# Altium schematic sheet sbcs.SchDoc
size A3; DocumentNumber: 43; SheetNumber: 43; SheetTotal: 45; SheetDescription: System basic chips for MCU and peripherals
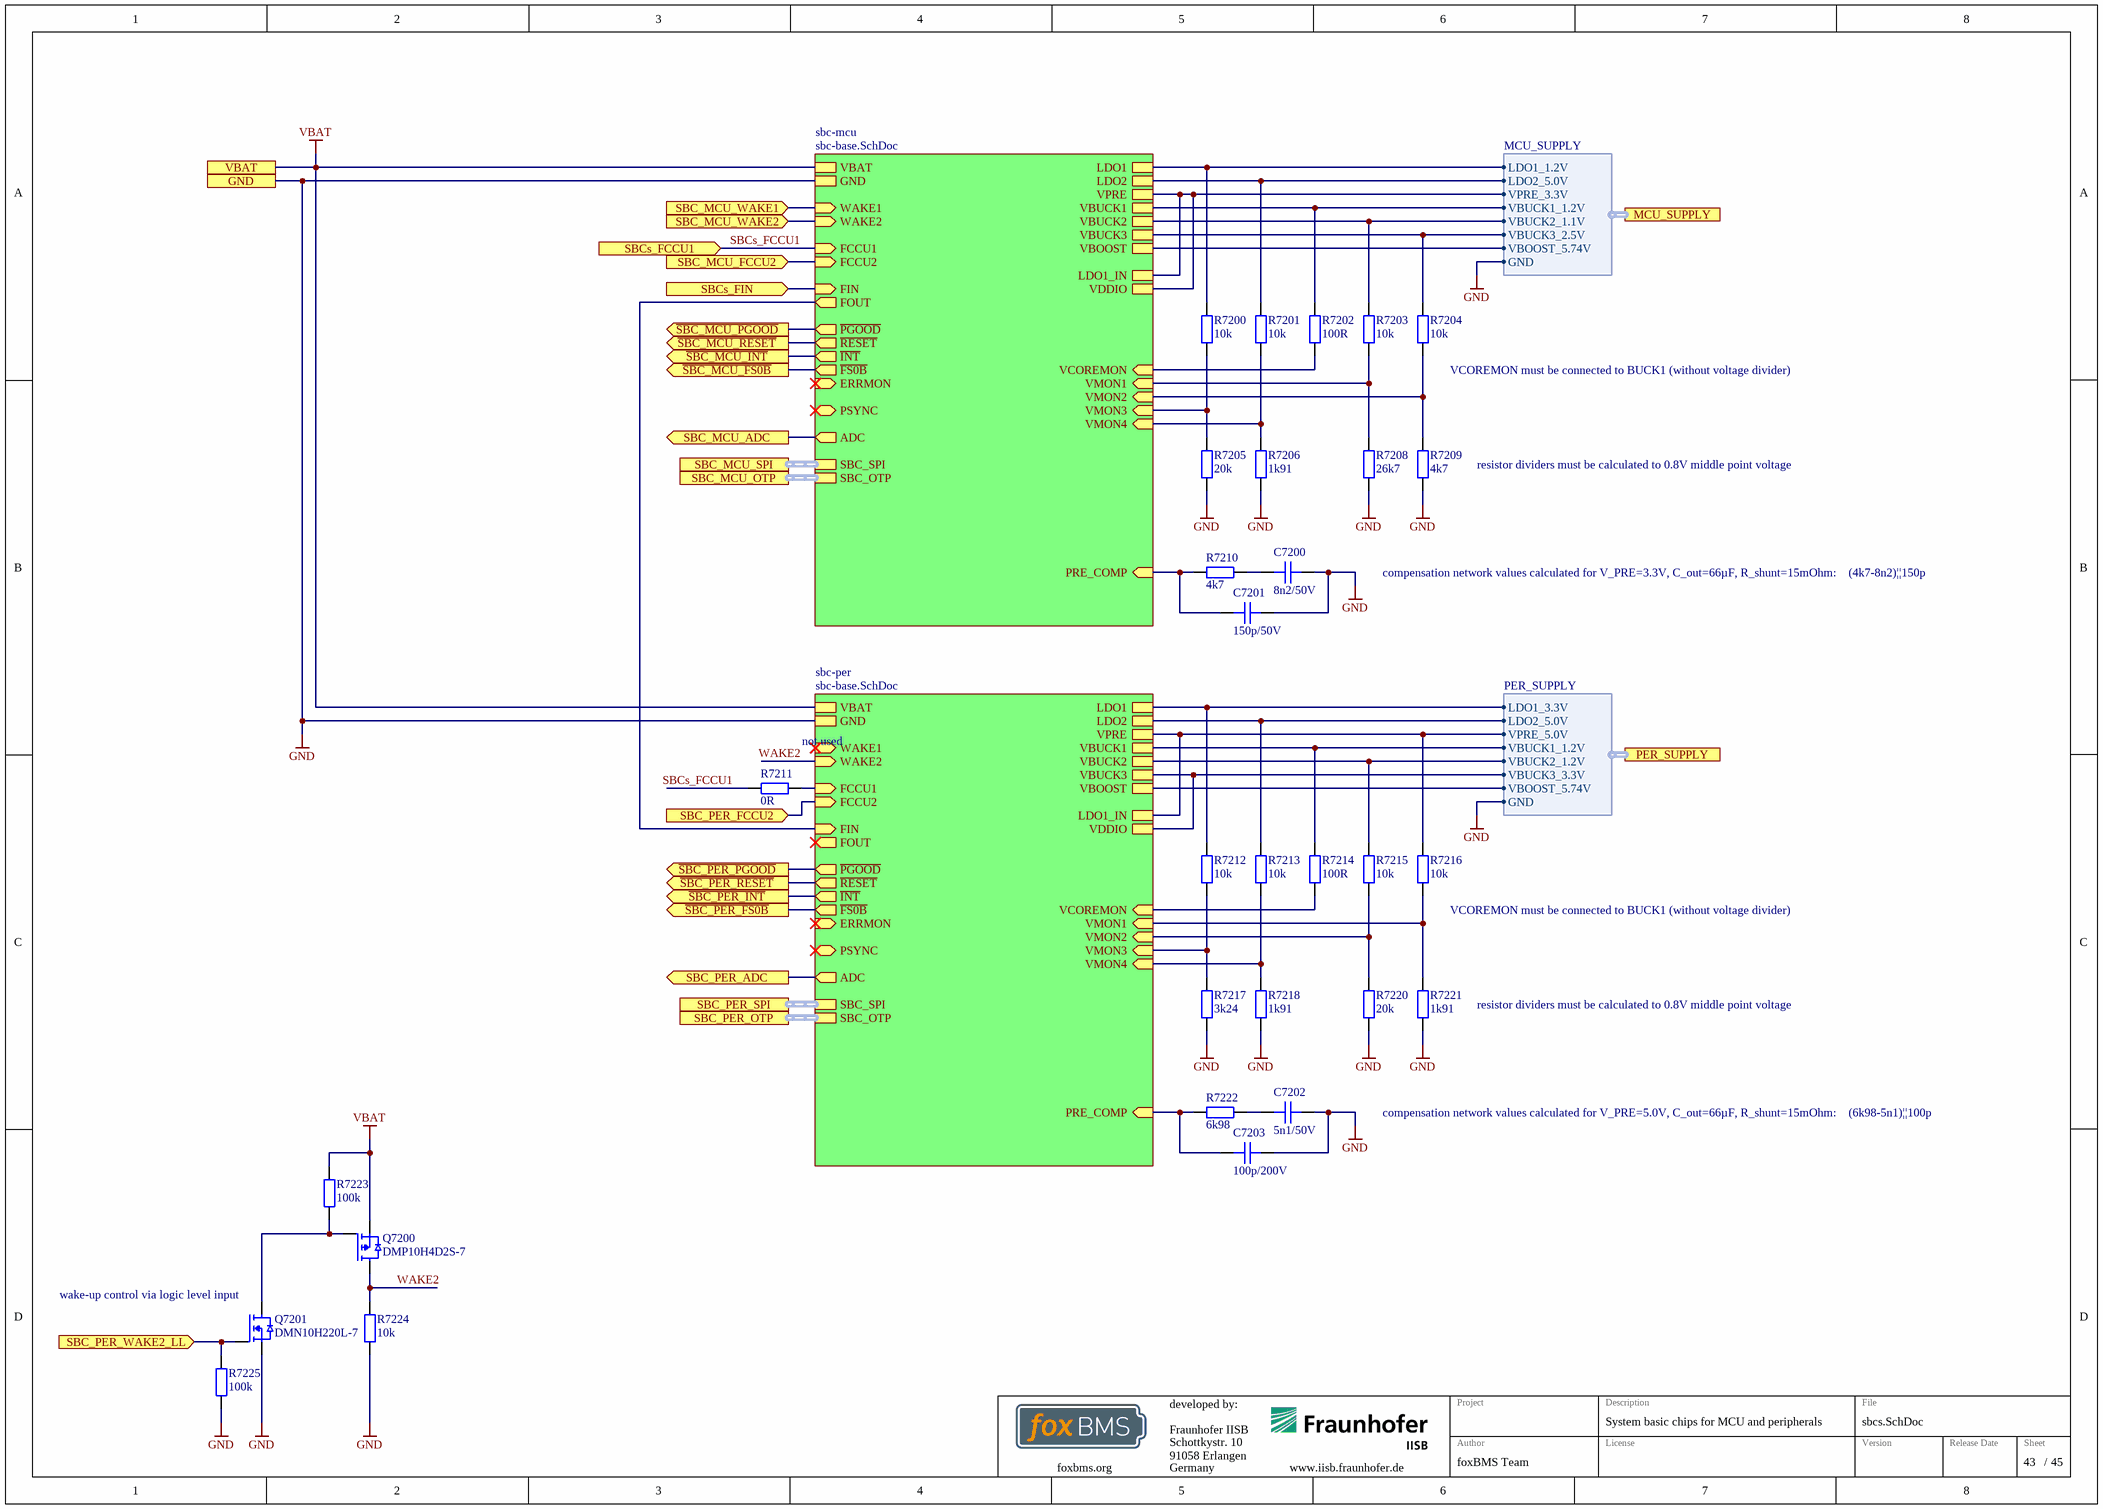
[diagram p0: sbcs.SchDoc]

## Parts
C7200  8n2/50V  [CAPC1608X08N]
C7201  150p/50V  [CAPC1005X06N]
C7202  5n1/50V  [CAPC1608X08N]
C7203  100p/200V  [CAPC1005X06N]
Q7200  DMP10H4D2S-7  [SOT95P237X110-3N]
Q7201  DMN10H220L-7  [SOT95P237X110-3N]
R7200  10k  [RESC1005X04N]
R7201  10k  [RESC1005X04N]
R7202  100R  [RESC1005X04N]
R7203  10k  [RESC1005X04N]
R7204  10k  [RESC1005X04N]
R7205  20k  [RESC1005X04N]
R7206  1k91  [RESC1005X04N]
R7208  26k7  [RESC1005X04N]
R7209  4k7  [RESC1005X04N]
R7210  4k7  [RESC1005X04N]
R7211  0R  [RESC1005X04N]
R7212  10k  [RESC1005X04N]
R7213  10k  [RESC1005X04N]
R7214  100R  [RESC1005X04N]
R7215  10k  [RESC1005X04N]
R7216  10k  [RESC1005X04N]
R7217  3k24  [RESC1005X04N]
R7218  1k91  [RESC1005X04N]
R7220  20k  [RESC1005X04N]
R7221  1k91  [RESC1005X04N]
R7222  6k98  [RESC1005X04N]
R7223  100k  [RESC1005X04N]
R7224  10k  [RESC1005X04N]
R7225  100k  [RESC1005X04N]

## Sub-sheets
sbc-mcu = sbc-base.SchDoc: ERRMON (in), FCCU1 (in), ~{FS0B} (out), ~{INT} (out), WAKE2 (in), VBAT, GND, ~{PGOOD} (out), ~{RESET} (out), FOUT (out), ADC (out), FCCU2 (in), PSYNC (bidir), SBC_OTP (harness SBC_OTP), VBUCK3, FIN (in), LDO2, VPRE, VBUCK1, VBUCK2, VCOREMON (in), VMON1 (in), VMON2 (in), VDDIO, LDO1_IN, PRE_COMP (in), VMON3 (in), VBOOST, SBC_SPI (harness SPI), LDO1, VMON4 (in), WAKE1 (in)
sbc-per = sbc-base.SchDoc: ERRMON (in), FCCU1 (in), ~{FS0B} (out), ~{INT} (out), WAKE2 (in), VBAT, GND, ~{PGOOD} (out), ~{RESET} (out), FOUT (out), ADC (out), FCCU2 (in), PSYNC (bidir), SBC_OTP (harness SBC_OTP), VBUCK3, FIN (in), LDO2, VPRE, VBUCK1, VBUCK2, VCOREMON (in), VMON1 (in), VMON2 (in), VDDIO, LDO1_IN, PRE_COMP (in), VMON3 (in), VBOOST, SBC_SPI (harness SPI), LDO1, VMON4 (in), WAKE1 (in)

## Ports
GND, MCU_SUPPLY (harness MCU_SUPPLY), PER_SUPPLY (harness PER_SUPPLY), SBC_MCU_ADC (out), SBC_MCU_FCCU2 (in), SBC_MCU_OTP (harness SBC_OTP), SBC_MCU_SPI (harness SPI), SBC_MCU_WAKE1 (in), SBC_MCU_WAKE2 (in), SBC_PER_ADC (out), SBC_PER_FCCU2 (in), SBC_PER_OTP (harness SBC_OTP), SBC_PER_SPI (harness SPI), SBC_PER_WAKE2_LL (in), SBCs_FCCU1 (in), SBCs_FIN (in), VBAT, ~{SBC_MCU_FS0B} (out), ~{SBC_MCU_INT} (out), ~{SBC_MCU_PGOOD} (out), ~{SBC_MCU_RESET} (out), ~{SBC_PER_FS0B} (out), ~{SBC_PER_INT} (out), ~{SBC_PER_PGOOD} (out), ~{SBC_PER_RESET} (out)

## Harnesses
MCU_SUPPLY: VBUCK1_1.2V, VBUCK2_1.1V, VBUCK3_2.5V, LDO1_1.2V, LDO2_5.0V, GND, VPRE_3.3V, VBOOST_5.74V
PER_SUPPLY: GND, VBOOST_5.74V, LDO1_3.3V, LDO2_5.0V, VPRE_5.0V, VBUCK1_1.2V, VBUCK2_1.2V, VBUCK3_3.3V

## Nets
GND: C7200.2 C7201.2 C7202.2 C7203.2 Q7201.S R7205.1 R7206.1 R7208.1 R7209.1 R7217.1 R7218.1 R7220.1 R7221.1 R7224.1 R7225.2 ; port GND, sheet sbc-mcu/GND, sheet sbc-per/GND, port MCU_SUPPLY.GND, port PER_SUPPLY.GND
VBAT: Q7200.S R7223.1 ; port VBAT, sheet sbc-mcu/VBAT, sheet sbc-per/VBAT
~{SBC_MCU_FS0B}: port ~{SBC_MCU_FS0B}, sheet sbc-mcu/~{FS0B}
~{SBC_MCU_INT}: port ~{SBC_MCU_INT}, sheet sbc-mcu/~{INT}
~{SBC_MCU_PGOOD}: port ~{SBC_MCU_PGOOD}, sheet sbc-mcu/~{PGOOD}
~{SBC_MCU_RESET}: port ~{SBC_MCU_RESET}, sheet sbc-mcu/~{RESET}
~{SBC_PER_FS0B}: port ~{SBC_PER_FS0B}, sheet sbc-per/~{FS0B}
~{SBC_PER_INT}: port ~{SBC_PER_INT}, sheet sbc-per/~{INT}
~{SBC_PER_PGOOD}: port ~{SBC_PER_PGOOD}, sheet sbc-per/~{PGOOD}
~{SBC_PER_RESET}: port ~{SBC_PER_RESET}, sheet sbc-per/~{RESET}
SBC_MCU_ADC: port SBC_MCU_ADC, sheet sbc-mcu/ADC
SBC_MCU_FCCU2: port SBC_MCU_FCCU2, sheet sbc-mcu/FCCU2
SBC_MCU_WAKE1: port SBC_MCU_WAKE1, sheet sbc-mcu/WAKE1
SBC_MCU_WAKE2: port SBC_MCU_WAKE2, sheet sbc-mcu/WAKE2
SBC_PER_ADC: port SBC_PER_ADC, sheet sbc-per/ADC
SBC_PER_FCCU2: port SBC_PER_FCCU2, sheet sbc-per/FCCU2
SBC_PER_WAKE2_LL: Q7201.G R7225.1 ; port SBC_PER_WAKE2_LL
SBCs_FCCU1: R7211.1 ; port SBCs_FCCU1, sheet sbc-mcu/FCCU1
SBCs_FIN: port SBCs_FIN, sheet sbc-mcu/FIN
WAKE2: Q7200.D R7224.2 ; sheet sbc-per/WAKE2
NetC7200_1: C7200.1 R7210.1
NetC7201_1: C7201.1 R7210.2 ; sheet sbc-mcu/PRE_COMP
NetC7202_1: C7202.1 R7222.1
NetC7203_1: C7203.1 R7222.2 ; sheet sbc-per/PRE_COMP
NetQ7200_G: Q7200.G Q7201.D R7223.2
NetR7200_1: R7200.1 R7205.2 ; sheet sbc-mcu/VMON3
NetR7200_2: R7200.2 ; sheet sbc-mcu/LDO1, port MCU_SUPPLY.LDO1_1.2V
NetR7201_1: R7201.1 R7206.2 ; sheet sbc-mcu/VMON4
NetR7201_2: R7201.2 ; sheet sbc-mcu/LDO2, port MCU_SUPPLY.LDO2_5.0V
NetR7202_1: R7202.1 ; sheet sbc-mcu/VCOREMON
NetR7202_2: R7202.2 ; sheet sbc-mcu/VBUCK1, port MCU_SUPPLY.VBUCK1_1.2V
NetR7203_1: R7203.1 R7208.2 ; sheet sbc-mcu/VMON1
NetR7203_2: R7203.2 ; sheet sbc-mcu/VBUCK2, port MCU_SUPPLY.VBUCK2_1.1V
NetR7204_1: R7204.1 R7209.2 ; sheet sbc-mcu/VMON2
NetR7204_2: R7204.2 ; sheet sbc-mcu/VBUCK3, port MCU_SUPPLY.VBUCK3_2.5V
NetR7211_2: R7211.2 ; sheet sbc-per/FCCU1
NetR7212_1: R7212.1 R7217.2 ; sheet sbc-per/VMON3
NetR7212_2: R7212.2 ; sheet sbc-per/LDO1, port PER_SUPPLY.LDO1_3.3V
NetR7213_1: R7213.1 R7218.2 ; sheet sbc-per/VMON4
NetR7213_2: R7213.2 ; sheet sbc-per/LDO2, port PER_SUPPLY.LDO2_5.0V
NetR7214_1: R7214.1 ; sheet sbc-per/VCOREMON
NetR7214_2: R7214.2 ; sheet sbc-per/VBUCK1, port PER_SUPPLY.VBUCK1_1.2V
NetR7215_1: R7215.1 R7220.2 ; sheet sbc-per/VMON2
NetR7215_2: R7215.2 ; sheet sbc-per/VBUCK2, port PER_SUPPLY.VBUCK2_1.2V
NetR7216_1: R7216.1 R7221.2 ; sheet sbc-per/VMON1
NetR7216_2: R7216.2 ; sheet sbc-per/VPRE, sheet sbc-per/LDO1_IN, port PER_SUPPLY.VPRE_5.0V
(unnamed): sheet sbc-mcu/FOUT, sheet sbc-per/FIN
(unnamed): sheet sbc-mcu/VPRE, sheet sbc-mcu/VDDIO, sheet sbc-mcu/LDO1_IN, port MCU_SUPPLY.VPRE_3.3V
(unnamed): sheet sbc-mcu/VBOOST, port MCU_SUPPLY.VBOOST_5.74V
(unnamed): sheet sbc-per/VBUCK3, sheet sbc-per/VDDIO, port PER_SUPPLY.VBUCK3_3.3V
(unnamed): sheet sbc-per/VBOOST, port PER_SUPPLY.VBOOST_5.74V

## Buses and harness runs
harness port SBC_MCU_OTP = sheet sbc-mcu/SBC_OTP
harness port SBC_MCU_SPI = sheet sbc-mcu/SBC_SPI
harness port SBC_PER_OTP = sheet sbc-per/SBC_OTP
harness port SBC_PER_SPI = sheet sbc-per/SBC_SPI

## Notes on the sheet
- (near R7204) VCOREMON must be connected to BUCK1 (without voltage divider)
- resistor dividers must be calculated to 0.8V middle point voltage
- compensation network values calculated for V_PRE=3.3V, C_out=66µF, R_shunt=15mOhm:
- (4k7-8n2)||150p
- (near R7211) not used
- (near R7216) VCOREMON must be connected to BUCK1 (without voltage divider)
- compensation network values calculated for V_PRE=5.0V, C_out=66µF, R_shunt=15mOhm:
- (6k98-5n1)||100p
- (near Q7201) wake-up control via logic level input
- Fraunhofer IISB
- Schottkystr. 10
- developed by:
- 91058 Erlangen
- Germany
- Author
- Project
- License
- Description
- File
- Version
- Release Date
- Sheet
- foxbms.org <https://foxbms.org>
- www.iisb.fraunhofer.de <https://www.iisb.fraunhofer.de/>
- foxBMS Team
- /

## Library data of the parts
C7200 = gen_C_ceramic_8n2_50V_C0G_0603: MLCC; Capacitance: 8n2; Rated Voltage: 50V; Dielectric: C0G; Case EIA: 0603; Case Metric: 1608; Automotive Qualified: True; PnP Package: 0603C; Part Number: gen_C_ceramic_8n2_50V_C0G_0603; Supplier 1: Digikey; Supplier Part Number 1: 445-8114-1-ND
C7201 = gen_C_ceramic_150p_50V_C0G_0402: MLCC; Capacitance: 150p; Rated Voltage: 50V; Dielectric: C0G; Case EIA: 0402; Case Metric: 1005; Automotive Qualified: True; PnP Package: 0402C; Part Number: gen_C_ceramic_150p_50V_C0G_0402; Supplier 1: Digikey; Supplier Part Number 1: 490-4926-1-ND
C7202 = gen_C_ceramic_5n1_50V_C0G_0603: MLCC; Capacitance: 5n1; Rated Voltage: 50V; Dielectric: C0G; Case EIA: 0603; Case Metric: 1608; Automotive Qualified: True; PnP Package: 0603C; Part Number: gen_C_ceramic_5n1_50V_C0G_0603; Supplier 1: Digikey; Supplier Part Number 1: 399-20395-1-ND
C7203 = gen_C_ceramic_100p_200V_C0G_0402: MLCC; Capacitance: 100p; Rated Voltage: 200V; Dielectric: C0G; Case EIA: 0402; Case Metric: 1005; Automotive Qualified: True; Tolerance: 5%; PnP Package: 0402C; Part Number: gen_C_ceramic_100p_200V_C0G_0402; Supplier 1: Farnell; Supplier Part Number 1: 2426878; Supplier 2: Digikey; Supplier Part Number 2: 399-11551-1-ND; Supplier 3: RS Components; Supplier Part Number 3: 8353949
Q7200 = DMP10H4D2S-7: MOSFET-Transistor, p-Kanal, 0.27 A, 100 V, 4.2 ohm; Manufacturer: Diodes; Maximum Drain-Source Voltage: 100V; Maximum Continous Drain Current (25°C): 0.27A; R_DS(on): 4.2; Total Gate Charge: 1.8nC; Automotive Qualified: True; Part Number: DMP10H4D2S-7; Part Name: PMOS; Operating Temperature: -55°C - +150°C; ComponentLink1Description: Datasheet; ComponentLink1URL: https://www.diodes.com/assets/Datasheets/DMP10H4D2S.pdf; Supplier 1: Farnell; Supplier Part Number 1: 3127354; Supplier 2: Digikey; Supplier Part Number 2: DMP10H4D2S-7DICT-ND; Supplier 3: Mouser; Supplier Part Number 3: 621-DMP10H4D2S-7
Q7201 = DMN10H220L-7: MOSFET-Transistor, n-Kanal, 1.6 A, 100 V, 0.250 ohm; Manufacturer: Diodes; Maximum Drain-Source Voltage: 100V; Maximum Continous Drain Current (25°C): 1.6A; R_DS(on): 250m; Total Gate Charge: 4.1nC; Automotive Qualified: True; Part Number: DMN10H220L-7; Part Name: NMOS; Operating Temperature: -55°C - +150°C; ComponentLink1Description: Datasheet; ComponentLink1URL: https://www.diodes.com/assets/Datasheets/DMN10H220L.pdf; Supplier 1: Digikey; Supplier Part Number 1: DMN10H220L-7DICT-ND; Supplier 2: Farnell; Supplier 3: Mouser; Supplier Part Number 2: 3127326; Supplier Part Number 3: 621-DMN10H220L-7
R7200 R7201 R7203 R7204 R7212 R7213 R7215 R7216 = gen_R_10k_0402: SMD Resistor 10k 0402; Tolerance: 1%; Power: 0.063W; Case EIA: 0402; Case Metric: 1005; Maximum Working Voltage: 50V; PnP Package: 0402R; Automotive Qualified: True; PnP equipped: x; AEC-Q Norm: AEC-Q200; Part Number: gen_R_10k_0402; Operating Temperature: -55°C - +155°C; Resistance: 10k; Series: E24, E96; PnP Value: 10k; Supplier 1: Farnell; Supplier Part Number 1: 2059239; ECCN: EAR99
R7202 R7214 = gen_R_100R_0402: SMD Resistor 100R 0402; Tolerance: 1%; Power: 0.063W; Case EIA: 0402; Case Metric: 1005; Maximum Working Voltage: 50V; PnP Package: 0402R; Automotive Qualified: True; PnP equipped: x; AEC-Q Norm: AEC-Q200; Part Number: gen_R_100R_0402; Operating Temperature: -55°C - +155°C; Resistance: 100R; Series: E24, E96; PnP Value: 100R; Supplier 1: Farnell; Supplier Part Number 1: 2302528; ECCN: EAR99
R7205 R7220 = gen_R_20k_0402: SMD Resistor 20k 0402; Tolerance: 1%; Power: 0.063W; Case EIA: 0402; Case Metric: 1005; Maximum Working Voltage: 50V; PnP Package: 0402R; Automotive Qualified: True; PnP equipped: x; AEC-Q Norm: AEC-Q200; Part Number: gen_R_20k_0402; Operating Temperature: -55°C - +155°C; Resistance: 20k; Series: E24, E96; PnP Value: 20k; Supplier 1: Farnell; Supplier Part Number 1: 2059242; Supplier 2: Farnell; Supplier Part Number 2: 2059160; ECCN: EAR99
R7206 R7218 R7221 = gen_R_1k91_0402: SMD Resistor 1k91 0402; Tolerance: 1%; Power: 0.063W; Case EIA: 0402; Case Metric: 1005; Maximum Working Voltage: 50V; PnP Package: 0402R; Automotive Qualified: True; AEC-Q Grade: Grade 0; AEC-Q Norm: AEC-Q200; Part Number: gen_R_1k91_0402; Operating Temperature: -55°C - +155°C; Resistance: 1k91; Series: E96; PnP Value: 1k91; ECCN: EAR99; Supplier 1: Digikey; Supplier Part Number 1: P1.91KLCT-ND
R7208 = gen_R_26k7_0402: SMD Resistor 26k7 0402; Tolerance: 1%; Power: 0.063W; Case EIA: 0402; Case Metric: 1005; Maximum Working Voltage: 50V; PnP Package: 0402R; Automotive Qualified: True; AEC-Q Grade: Grade 0; AEC-Q Norm: AEC-Q200; Part Number: gen_R_26k7_0402; Operating Temperature: -55°C - +155°C; Resistance: 26k7; Series: E96; PnP Value: 26k7; ECCN: EAR99; Supplier 1: Digikey; Supplier Part Number 1: P26.7KLCT-ND
R7209 R7210 = gen_R_4k7_0402: SMD Resistor 4k7 0402; Tolerance: 1%; Power: 0.063W; Case EIA: 0402; Case Metric: 1005; Maximum Working Voltage: 50V; PnP Package: 0402R; Automotive Qualified: True; PnP equipped: x; Part Number: gen_R_4k7_0402; Operating Temperature: -55°C - +155°C; Resistance: 4k7; Series: E24; PnP Value: 4k7; Supplier 1: Farnell; Supplier Part Number 1: 2302707
R7211 = gen_R_0R_0402: SMD Resistor 0R 0402; Power: 0.063W; Case EIA: 0402; Case Metric: 1005; Maximum Working Voltage: 50V; PnP Package: 0402R; Automotive Qualified: True; AEC-Q Norm: AEC-Q200; PnP equipped: x; Part Number: gen_R_0R_0402; Operating Temperature: -55°C - +155°C; Resistance: 0R; Series: Jumper; PnP Value: 0R; Supplier 1: Farnell; Supplier Part Number 1: 1469661; Supplier 2: Farnell; Supplier Part Number 2: 2059190; ECCN: EAR99
R7217 = gen_R_3k24_0402: SMD Resistor 3k24 0402; Tolerance: 1%; Power: 0.063W; Case EIA: 0402; Case Metric: 1005; Maximum Working Voltage: 50V; PnP Package: 0402R; Automotive Qualified: True; AEC-Q Grade: Grade 0; AEC-Q Norm: AEC-Q200; Part Number: gen_R_3k24_0402; Operating Temperature: -55°C - +155°C; Resistance: 3k24; Series: E96; PnP Value: 3k24; ECCN: EAR99; Supplier 1: Farnell; Supplier Part Number 1: 2302689
R7222 = gen_R_6k98_0402: SMD Resistor 6k98 0402; Tolerance: 1%; Power: 0.063W; Case EIA: 0402; Case Metric: 1005; Maximum Working Voltage: 50V; PnP Package: 0402R; Automotive Qualified: True; AEC-Q Grade: Grade 0; AEC-Q Norm: AEC-Q200; Part Number: gen_R_6k98_0402; Operating Temperature: -55°C - +155°C; Resistance: 6k98; Series: E96; PnP Value: 6k98; ECCN: EAR99; Supplier 1: Farnell; Supplier Part Number 1: 2302725
R7223 R7225 = gen_R_100k_0402: SMD Resistor 100k 0402; Tolerance: 1%; Power: 0.063W; Case EIA: 0402; Case Metric: 1005; Maximum Working Voltage: 50V; PnP Package: 0402R; PnP equipped: x; Automotive Qualified: True; Part Number: gen_R_100k_0402; Operating Temperature: -55°C - +155°C; Resistance: 100k; Series: E24, E96; PnP Value: 100k; Supplier 1: Farnell; Supplier Part Number 1: 2302839
R7224 = gen_R_10k_0402: SMD Resistor 10k 0402; Tolerance: 1%; Power: 0.063W; Case EIA: 0402; Case Metric: 1005; Maximum Working Voltage: 50V; PnP Package: 0402R; PnP equipped: x; Automotive Qualified: True; AEC-Q Norm: AEC-Q200; Part Number: gen_R_10k_0402; Operating Temperature: -55°C - +155°C; Resistance: 10k; Series: E24, E96; PnP Value: 10k; Supplier 1: Farnell; Supplier Part Number 1: 2059239; ECCN: EAR99